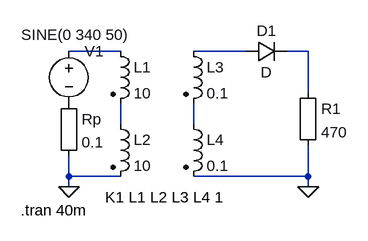
[diagram p0: schematic HalfWaveRectifier.asc]
HalfWaveRectifier.asc, the LTspice schematic file:
Version 4
SHEET 1 880 680
WIRE 16 32 -64 32
WIRE 208 32 128 32
WIRE 304 32 272 32
WIRE 304 96 304 32
WIRE 16 144 16 112
WIRE 128 144 128 112
WIRE -64 224 -64 192
WIRE 16 224 -64 224
WIRE 304 224 304 176
WIRE 304 224 128 224
WIRE -64 240 -64 224
WIRE 304 240 304 224
FLAG 304 240 0
FLAG -64 240 0
SYMBOL ind2 0 16 R0
SYMATTR InstName L1
SYMATTR Value 10
SYMATTR Type ind
SYMBOL ind2 0 128 R0
SYMATTR InstName L2
SYMATTR Value 10
SYMATTR Type ind
SYMBOL ind2 112 16 R0
SYMATTR InstName L3
SYMATTR Value 0.1
SYMATTR Type ind
SYMBOL ind2 112 128 R0
SYMATTR InstName L4
SYMATTR Value 0.1
SYMATTR Type ind
SYMBOL voltage -64 16 R0
WINDOW 3 -73 -10 Left 2
WINDOW 123 0 0 Left 2
WINDOW 39 0 0 Left 2
SYMATTR InstName V1
SYMATTR Value SINE(0 340 50)
SYMBOL diode 208 48 R270
WINDOW 0 32 32 VTop 2
WINDOW 3 0 32 VBottom 2
SYMATTR InstName D1
SYMBOL Misc\\EuropeanResistor 288 80 R0
SYMATTR InstName R1
SYMATTR Value 470
SYMBOL Misc\\EuropeanResistor -80 96 R0
SYMATTR InstName Rp
SYMATTR Value 0.1
TEXT -8 256 Left 2 !K1 L1 L2 L3 L4 1
TEXT -138 276 Left 2 !.tran 40m

The netlist it stands for:
* HalfWaveRectifier.asc
L1 N001 N004 10
L2 N004 0 10
L3 N002 N005 0.1
L4 N005 0 0.1
V1 N001 P001 SINE(0 340 50)
D1 N002 N003 D
R1 N003 0 470
Rp P001 0 0.1
.model D D
.lib standard.dio
K1 L1 L2 L3 L4 1
.tran 40m
.backanno
.end